# Altium schematic sheet Connector_SOM240_1.SchDoc: =SheetTitle_Top
size 420 x 297 mm; EDA_Number: ARTIQ; Author: G.Kasprowicz; CompanyName: WUT ISE; DrawnBy: G.Kasprowicz; Organization: WUT ISE; Address1: PW ISE; Address2: Nowowiejska 15/19 00-665 Warsaw; Address3: gkasprow@gmail.com; ModifiedBy: -; CheckedDate: -; Title2: K24/K26 SOM240_1 Connector; DivGrp: WUT ISE; Designer: G.Kasprowicz; ModifiedDate: -; ProjectName: Sensor Box
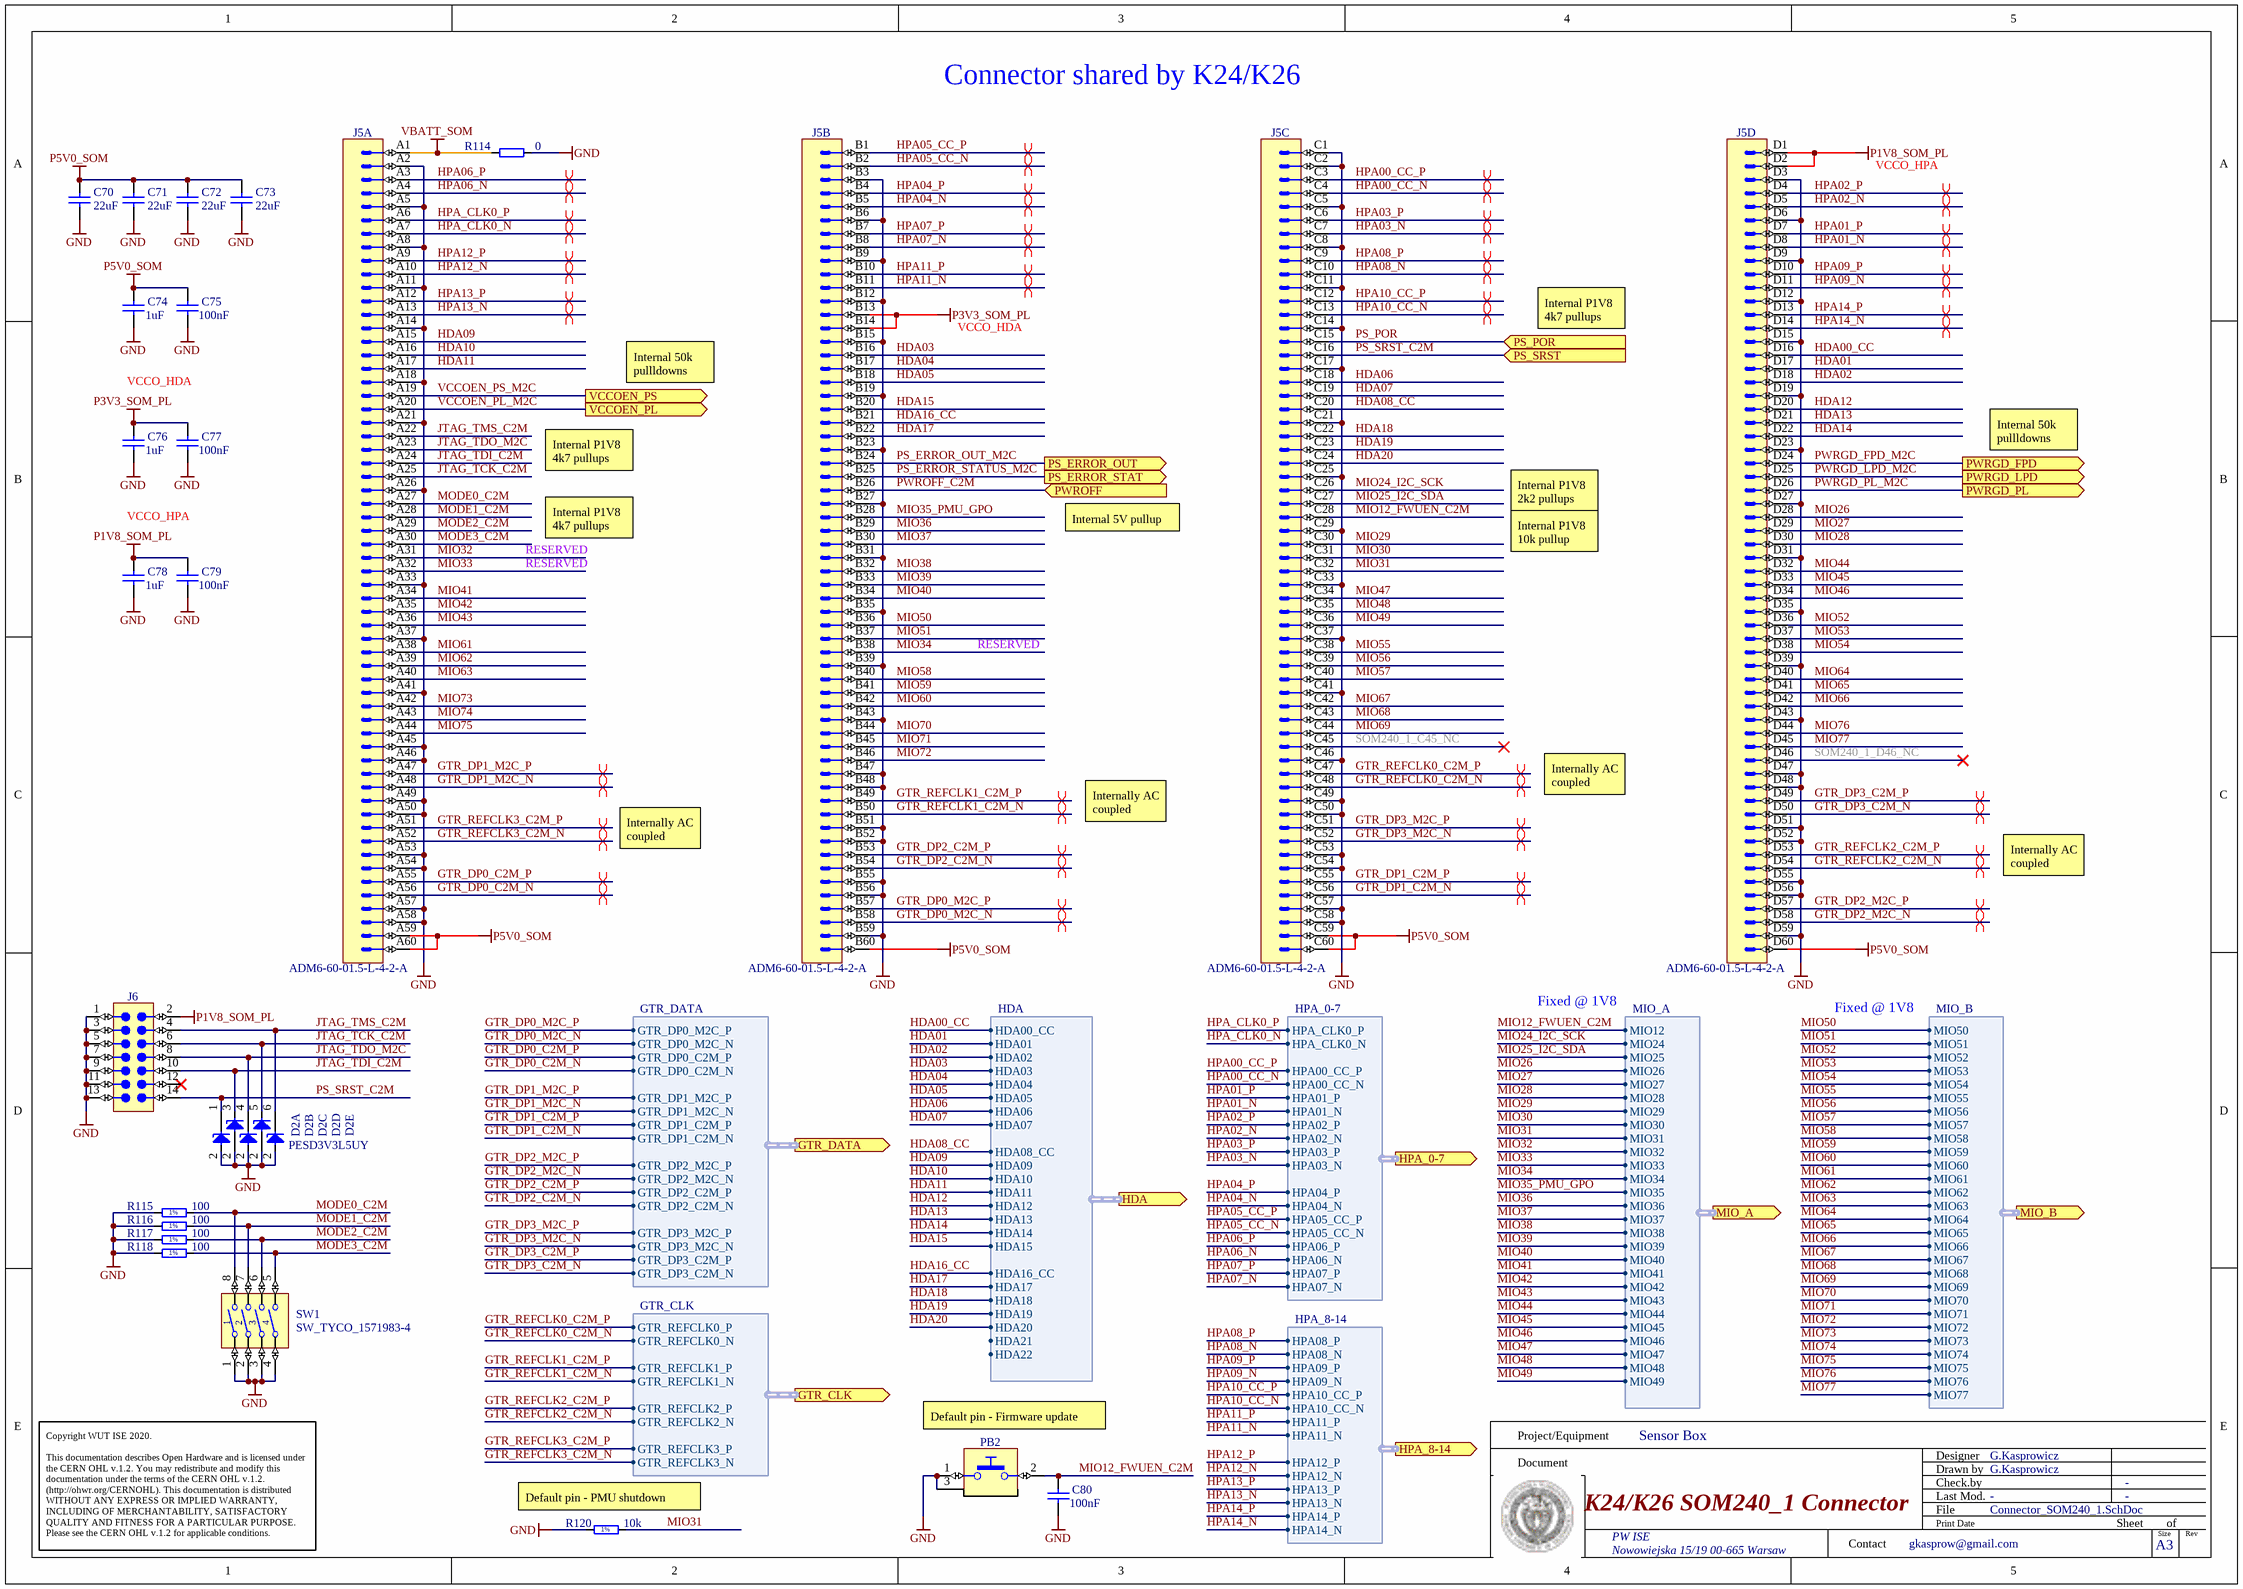
[diagram p0: Connector_SOM240_1.SchDoc]

## Parts
C70  22uF  [CAPC2012X135N]
C71  22uF  [CAPC2012X135N]
C72  22uF  [CAPC2012X135N]
C73  22uF  [CAPC2012X135N]
C74  1uF  [CAPC1005X55N]
C75  100nF  [CAPC1005X55N]
C76  1uF  [CAPC1005X55N]
C77  100nF  [CAPC1005X55N]
C78  1uF  [CAPC1005X55N]
C79  100nF  [CAPC1005X55N]
C80  100nF  [CAPC1005X55N]
D2  PESD3V3L5UY  [SOT65P210X110-6N]  (value not drawn)  (parts A,B,C,D,E of 5)
J5  Manufacturer Part Number: ADM6-60-01.5-L-4-2-A  [SAMTEC_ADM6-60-01.5-L-4-2-A]  (hidden comment: Header 240)  (parts A,B,C,D of 4)
J6  (no value)  [MOLEX_87832-1420]
PB2  (no value)  [PB_OMRON_B3U-1100P]
R114  0  [RESC1005X40N]
R115  100  [RESC1005X40N]
R116  100  [RESC1005X40N]
R117  100  [RESC1005X40N]
R118  100  [RESC1005X40N]
R120  10k  [RESC1005X40N]
SW1  Switch  [SW_TYCO_1571983-4]  (value not drawn)

## Ports
GTR_CLK (out, harness GTR_CLK), GTR_DATA (out, harness GTR_DATA), HDA (out, harness HDA), HPA_0-7 (out, harness HPA_0-7), HPA_8-14 (out, harness HPA_8-14), MIO_A (out, harness MIO_A), MIO_B (out, harness MIO_B), PS_ERROR_OUT (out), PS_ERROR_STAT (out), PS_POR (in), PS_SRST (in), PWRGD_FPD (out), PWRGD_LPD (out), PWRGD_PL (out), PWROFF (in), VCCOEN_PL (out), VCCOEN_PS (out)

## Harnesses
GTR_DATA: GTR_DP0_M2C_P, GTR_DP0_M2C_N, GTR_DP0_C2M_P, GTR_DP0_C2M_N, GTR_DP1_M2C_P, GTR_DP1_M2C_N, GTR_DP1_C2M_P, GTR_DP1_C2M_N, GTR_DP2_M2C_P, GTR_DP2_M2C_N, GTR_DP2_C2M_P, GTR_DP2_C2M_N, GTR_DP3_M2C_P, GTR_DP3_M2C_N, GTR_DP3_C2M_P, GTR_DP3_C2M_N
GTR_CLK: GTR_REFCLK0_P, GTR_REFCLK0_N, GTR_REFCLK1_P, GTR_REFCLK1_N, GTR_REFCLK2_P, GTR_REFCLK2_N, GTR_REFCLK3_P, GTR_REFCLK3_N
HDA: HDA00_CC, HDA01, HDA02, HDA03, HDA04, HDA06, HDA07, HDA05, HDA08_CC, HDA09, HDA10, HDA11, HDA12, HDA13, HDA14, HDA15, HDA16_CC, HDA17, HDA18, HDA19, HDA20, HDA21, HDA22
HPA_0-7: HPA_CLK0_P, HPA_CLK0_N, HPA00_CC_P, HPA00_CC_N, HPA01_P, HPA01_N, HPA02_P, HPA02_N, HPA03_P, HPA03_N, HPA04_P, HPA04_N, HPA05_CC_P, HPA05_CC_N, HPA06_P, HPA06_N, HPA07_P, HPA07_N
HPA_8-14: HPA08_P, HPA08_N, HPA09_P, HPA09_N, HPA10_CC_P, HPA10_CC_N, HPA11_P, HPA11_N, HPA12_P, HPA12_N, HPA13_P, HPA13_N, HPA14_P, HPA14_N
MIO_A: MIO12, MIO24, MIO25, MIO26, MIO27, MIO28, MIO29, MIO30, MIO31, MIO32, MIO33, MIO34, MIO35, MIO36, MIO37, MIO38, MIO39, MIO40, MIO41, MIO42, MIO43, MIO44, MIO45, MIO46, MIO47, MIO48, MIO49
MIO_B: MIO50, MIO51, MIO52, MIO53, MIO54, MIO55, MIO56, MIO57, MIO58, MIO59, MIO60, MIO61, MIO62, MIO63, MIO64, MIO65, MIO66, MIO67, MIO68, MIO69, MIO70, MIO71, MIO72, MIO73, MIO74, MIO75, MIO76, MIO77

## Nets
GND: C70.1 C71.1 C72.1 C73.1 C74.1 C75.1 C76.1 C77.1 C78.1 C79.1 C80.1 D2.2(A) J5.A2 J5.A5 J5.A8 J5.A11 J5.A14 J5.A18 J5.A21 J5.A26 J5.A33 J5.A37 J5.A41 J5.A45 J5.A46 J5.A49 J5.A50 J5.A53 J5.A54 J5.A57 J5.A58 J5.B3 J5.B6 J5.B9 J5.B12 J5.B15 J5.B19 J5.B23 J5.B27 J5.B31 J5.B35 J5.B39 J5.B43 J5.B47 J5.B48 J5.B51 J5.B52 J5.B55 J5.B56 J5.B59 J5.C1 J5.C2 J5.C5 J5.C8 J5.C11 J5.C14 J5.C17 J5.C21 J5.C25 J5.C29 J5.C33 J5.C37 J5.C41 J5.C46 J5.C49 J5.C50 J5.C53 J5.C54 J5.C57 J5.C58 J5.D3 J5.D6 J5.D9 J5.D12 J5.D15 J5.D19 J5.D23 J5.D27 J5.D31 J5.D35 J5.D39 J5.D43 J5.D47 J5.D48 J5.D51 J5.D52 J5.D55 J5.D56 J5.D59 J6.1 J6.3 J6.5 J6.7 J6.9 J6.11 J6.13 PB2.1 PB2.3 R114.2 R115.1 R116.1 R117.1 R118.1 R120.1 SW1.1 SW1.2 SW1.3 SW1.4
P1V8_SOM_PL: C78.2 C79.2 J5.D1 J5.D2 J6.2
P3V3_SOM_PL: C76.2 C77.2 J5.B13 J5.B14
P5V0_SOM: C70.2 C71.2 C72.2 C73.2 C74.2 C75.2 J5.A59 J5.A60 J5.B60 J5.C59 J5.C60 J5.D60
VBATT_SOM: J5.A1 R114.1
GTR_DP0_C2M_N: J5.A56 ; port GTR_DATA.GTR_DP0_C2M_N
GTR_DP0_C2M_P: J5.A55 ; port GTR_DATA.GTR_DP0_C2M_P
GTR_DP0_M2C_N: J5.B58 ; port GTR_DATA.GTR_DP0_M2C_N
GTR_DP0_M2C_P: J5.B57 ; port GTR_DATA.GTR_DP0_M2C_P
GTR_DP1_C2M_N: J5.C56 ; port GTR_DATA.GTR_DP1_C2M_N
GTR_DP1_C2M_P: J5.C55 ; port GTR_DATA.GTR_DP1_C2M_P
GTR_DP1_M2C_N: J5.A48 ; port GTR_DATA.GTR_DP1_M2C_N
GTR_DP1_M2C_P: J5.A47 ; port GTR_DATA.GTR_DP1_M2C_P
GTR_DP2_C2M_N: J5.B54 ; port GTR_DATA.GTR_DP2_C2M_N
GTR_DP2_C2M_P: J5.B53 ; port GTR_DATA.GTR_DP2_C2M_P
GTR_DP2_M2C_N: J5.D58 ; port GTR_DATA.GTR_DP2_M2C_N
GTR_DP2_M2C_P: J5.D57 ; port GTR_DATA.GTR_DP2_M2C_P
GTR_DP3_C2M_N: J5.D50 ; port GTR_DATA.GTR_DP3_C2M_N
GTR_DP3_C2M_P: J5.D49 ; port GTR_DATA.GTR_DP3_C2M_P
GTR_DP3_M2C_N: J5.C52 ; port GTR_DATA.GTR_DP3_M2C_N
GTR_DP3_M2C_P: J5.C51 ; port GTR_DATA.GTR_DP3_M2C_P
GTR_REFCLK0_C2M_N: J5.C48 ; port GTR_CLK.GTR_REFCLK0_N
GTR_REFCLK0_C2M_P: J5.C47 ; port GTR_CLK.GTR_REFCLK0_P
GTR_REFCLK1_C2M_N: J5.B50 ; port GTR_CLK.GTR_REFCLK1_N
GTR_REFCLK1_C2M_P: J5.B49 ; port GTR_CLK.GTR_REFCLK1_P
GTR_REFCLK2_C2M_N: J5.D54 ; port GTR_CLK.GTR_REFCLK2_N
GTR_REFCLK2_C2M_P: J5.D53 ; port GTR_CLK.GTR_REFCLK2_P
GTR_REFCLK3_C2M_N: J5.A52 ; port GTR_CLK.GTR_REFCLK3_N
GTR_REFCLK3_C2M_P: J5.A51 ; port GTR_CLK.GTR_REFCLK3_P
HDA00_CC: J5.D16 ; port HDA.HDA00_CC
HDA01: J5.D17 ; port HDA.HDA01
HDA02: J5.D18 ; port HDA.HDA02
HDA03: J5.B16 ; port HDA.HDA03
HDA04: J5.B17 ; port HDA.HDA04
HDA05: J5.B18 ; port HDA.HDA05
HDA06: J5.C18 ; port HDA.HDA06
HDA07: J5.C19 ; port HDA.HDA07
HDA08_CC: J5.C20 ; port HDA.HDA08_CC
HDA09: J5.A15 ; port HDA.HDA09
HDA10: J5.A16 ; port HDA.HDA10
HDA11: J5.A17 ; port HDA.HDA11
HDA12: J5.D20 ; port HDA.HDA12
HDA13: J5.D21 ; port HDA.HDA13
HDA14: J5.D22 ; port HDA.HDA14
HDA15: J5.B20 ; port HDA.HDA15
HDA16_CC: J5.B21 ; port HDA.HDA16_CC
HDA17: J5.B22 ; port HDA.HDA17
HDA18: J5.C22 ; port HDA.HDA18
HDA19: J5.C23 ; port HDA.HDA19
HDA20: J5.C24 ; port HDA.HDA20
HPA00_CC_N: J5.C4 ; port HPA_0-7.HPA00_CC_N
HPA00_CC_P: J5.C3 ; port HPA_0-7.HPA00_CC_P
HPA01_N: J5.D8 ; port HPA_0-7.HPA01_N
HPA01_P: J5.D7 ; port HPA_0-7.HPA01_P
HPA02_N: J5.D5 ; port HPA_0-7.HPA02_N
HPA02_P: J5.D4 ; port HPA_0-7.HPA02_P
HPA03_N: J5.C7 ; port HPA_0-7.HPA03_N
HPA03_P: J5.C6 ; port HPA_0-7.HPA03_P
HPA04_N: J5.B5 ; port HPA_0-7.HPA04_N
HPA04_P: J5.B4 ; port HPA_0-7.HPA04_P
HPA05_CC_N: J5.B2 ; port HPA_0-7.HPA05_CC_N
HPA05_CC_P: J5.B1 ; port HPA_0-7.HPA05_CC_P
HPA06_N: J5.A4 ; port HPA_0-7.HPA06_N
HPA06_P: J5.A3 ; port HPA_0-7.HPA06_P
HPA07_N: J5.B8 ; port HPA_0-7.HPA07_N
HPA07_P: J5.B7 ; port HPA_0-7.HPA07_P
HPA08_N: J5.C10 ; port HPA_8-14.HPA08_N
HPA08_P: J5.C9 ; port HPA_8-14.HPA08_P
HPA09_N: J5.D11 ; port HPA_8-14.HPA09_N
HPA09_P: J5.D10 ; port HPA_8-14.HPA09_P
HPA10_CC_N: J5.C13 ; port HPA_8-14.HPA10_CC_N
HPA10_CC_P: J5.C12 ; port HPA_8-14.HPA10_CC_P
HPA11_N: J5.B11 ; port HPA_8-14.HPA11_N
HPA11_P: J5.B10 ; port HPA_8-14.HPA11_P
HPA12_N: J5.A10 ; port HPA_8-14.HPA12_N
HPA12_P: J5.A9 ; port HPA_8-14.HPA12_P
HPA13_N: J5.A13 ; port HPA_8-14.HPA13_N
HPA13_P: J5.A12 ; port HPA_8-14.HPA13_P
HPA14_N: J5.D14 ; port HPA_8-14.HPA14_N
HPA14_P: J5.D13 ; port HPA_8-14.HPA14_P
HPA_CLK0_N: J5.A7 ; port HPA_0-7.HPA_CLK0_N
HPA_CLK0_P: J5.A6 ; port HPA_0-7.HPA_CLK0_P
JTAG_TCK_C2M: D2.5(C) J5.A25 J6.6
JTAG_TDI_C2M: D2.3(C) J5.A24 J6.10
JTAG_TDO_M2C: D2.4(C) J5.A23 J6.8
JTAG_TMS_C2M: D2.6(C) J5.A22 J6.4
MIO12_FWUEN_C2M: C80.2 J5.C28 PB2.2 ; port MIO_A.MIO12
MIO24_I2C_SCK: J5.C26 ; port MIO_A.MIO24
MIO25_I2C_SDA: J5.C27 ; port MIO_A.MIO25
MIO26: J5.D28 ; port MIO_A.MIO26
MIO27: J5.D29 ; port MIO_A.MIO27
MIO28: J5.D30 ; port MIO_A.MIO28
MIO29: J5.C30 ; port MIO_A.MIO29
MIO30: J5.C31 ; port MIO_A.MIO30
MIO31: J5.C32 R120.2 ; port MIO_A.MIO31
MIO32: J5.A31 ; port MIO_A.MIO32
MIO33: J5.A32 ; port MIO_A.MIO33
MIO34: J5.B38 ; port MIO_A.MIO34
MIO35_PMU_GPO: J5.B28 ; port MIO_A.MIO35
MIO36: J5.B29 ; port MIO_A.MIO36
MIO37: J5.B30 ; port MIO_A.MIO37
MIO38: J5.B32 ; port MIO_A.MIO38
MIO39: J5.B33 ; port MIO_A.MIO39
MIO40: J5.B34 ; port MIO_A.MIO40
MIO41: J5.A34 ; port MIO_A.MIO41
MIO42: J5.A35 ; port MIO_A.MIO42
MIO43: J5.A36 ; port MIO_A.MIO43
MIO44: J5.D32 ; port MIO_A.MIO44
MIO45: J5.D33 ; port MIO_A.MIO45
MIO46: J5.D34 ; port MIO_A.MIO46
MIO47: J5.C34 ; port MIO_A.MIO47
MIO48: J5.C35 ; port MIO_A.MIO48
MIO49: J5.C36 ; port MIO_A.MIO49
MIO50: J5.B36 ; port MIO_B.MIO50
MIO51: J5.B37 ; port MIO_B.MIO51
MIO52: J5.D36 ; port MIO_B.MIO52
MIO53: J5.D37 ; port MIO_B.MIO53
MIO54: J5.D38 ; port MIO_B.MIO54
MIO55: J5.C38 ; port MIO_B.MIO55
MIO56: J5.C39 ; port MIO_B.MIO56
MIO57: J5.C40 ; port MIO_B.MIO57
MIO58: J5.B40 ; port MIO_B.MIO58
MIO59: J5.B41 ; port MIO_B.MIO59
MIO60: J5.B42 ; port MIO_B.MIO60
MIO61: J5.A38 ; port MIO_B.MIO61
MIO62: J5.A39 ; port MIO_B.MIO62
MIO63: J5.A40 ; port MIO_B.MIO63
MIO64: J5.D40 ; port MIO_B.MIO64
MIO65: J5.D41 ; port MIO_B.MIO65
MIO66: J5.D42 ; port MIO_B.MIO66
MIO67: J5.C42 ; port MIO_B.MIO67
MIO68: J5.C43 ; port MIO_B.MIO68
MIO69: J5.C44 ; port MIO_B.MIO69
MIO70: J5.B44 ; port MIO_B.MIO70
MIO71: J5.B45 ; port MIO_B.MIO71
MIO72: J5.B46 ; port MIO_B.MIO72
MIO73: J5.A42 ; port MIO_B.MIO73
MIO74: J5.A43 ; port MIO_B.MIO74
MIO75: J5.A44 ; port MIO_B.MIO75
MIO76: J5.D44 ; port MIO_B.MIO76
MIO77: J5.D45 ; port MIO_B.MIO77
MODE0_C2M: J5.A27 R115.2 SW1.8
MODE1_C2M: J5.A28 R116.2 SW1.7
MODE2_C2M: J5.A29 R117.2 SW1.6
MODE3_C2M: J5.A30 R118.2 SW1.5
PS_ERROR_OUT_M2C: J5.B24 ; port PS_ERROR_OUT
PS_ERROR_STATUS_M2C: J5.B25 ; port PS_ERROR_STAT
PS_POR: J5.C15 ; port PS_POR
PS_SRST_C2M: D2.1(C) J5.C16 J6.14 ; port PS_SRST
PWRGD_FPD_M2C: J5.D24 ; port PWRGD_FPD
PWRGD_LPD_M2C: J5.D25 ; port PWRGD_LPD
PWRGD_PL_M2C: J5.D26 ; port PWRGD_PL
PWROFF_C2M: J5.B26 ; port PWROFF
SOM240_1_C45_NC: J5.C45
SOM240_1_D46_NC: J5.D46
VCCOEN_PL_M2C: J5.A20 ; port VCCOEN_PL
VCCOEN_PS_M2C: J5.A19 ; port VCCOEN_PS

Not connected (* = marked no-connect by the designer): J6 12*

## Layout directives
differential pair; differential pair class Diff_GTR: GTR_DP0_C2M_N, GTR_DP0_C2M_P, GTR_DP0_M2C_N, GTR_DP0_M2C_P, GTR_DP1_C2M_N, GTR_DP1_C2M_P, GTR_DP1_M2C_N, GTR_DP1_M2C_P, GTR_DP2_C2M_N, GTR_DP2_C2M_P, GTR_DP2_M2C_N, GTR_DP2_M2C_P, GTR_DP3_C2M_N, GTR_DP3_C2M_P, GTR_DP3_M2C_N, GTR_DP3_M2C_P, GTR_REFCLK0_C2M_N, GTR_REFCLK0_C2M_P, GTR_REFCLK1_C2M_N, GTR_REFCLK1_C2M_P, GTR_REFCLK2_C2M_N, GTR_REFCLK2_C2M_P, GTR_REFCLK3_C2M_N, GTR_REFCLK3_C2M_P
differential pair; differential pair class Diff_HPA: HPA00_CC_N, HPA00_CC_P, HPA01_N, HPA01_P, HPA02_N, HPA02_P, HPA03_N, HPA03_P, HPA04_N, HPA04_P, HPA05_CC_N, HPA05_CC_P, HPA06_N, HPA06_P, HPA07_N, HPA07_P, HPA08_N, HPA08_P, HPA09_N, HPA09_P, HPA10_CC_N, HPA10_CC_P, HPA11_N, HPA11_P, HPA12_N, HPA12_P, HPA13_N, HPA13_P, HPA14_N, HPA14_P, HPA_CLK0_N, HPA_CLK0_P

## Notes on the sheet
- Connector shared by K24/K26
- VCCO_HPA
- Internal P1V8 4k7 pullups
- VCCO_HDA
- Internal 50k pullldowns
- Internal 5V pullup
- Internal P1V8 2k2 pullups
- RESERVED
- Internal P1V8 10k pullup
- Internally AC coupled
- Fixed @ 1V8
- Default pin - Firmware update
- (near R120) Default pin - PMU shutdown
- Project/Equipment
- Document
- Designer
- Drawn by
- Check.by
- Copyright WUT ISE 2020.
  This documentation describes Open Hardware and is licensed under the CERN OHL v.1.2. You may redistribute and modify this documentation under the terms of the CERN OHL v.1.2. (http://ohwr.org/CERNOHL). This documentation is distributed WITHOUT ANY EXPRESS OR IMPLIED WARRANTY, INCLUDING OF MERCHANTABILITY, SATISFACTORY QUALITY AND FITNESS FOR A PARTICULAR PURPOSE. Please see the CERN OHL v.1.2 for applicable conditions.
- Contact
- File
- Last Mod.
- Print Date
- Sheet
- Size
- A3
- of
- Rev
- (in symbol R0402_10K_1%_0.0625W_100PPM) 1%
- (in symbol R0402_100R_1%_0.0625W_100PPM) 1%

## Library data of the parts
C70-C73 = CC0805_22UF_16V_10%_X5R: Non-polarised capacitor; Part Description: SMD Multilayer Chip Ceramic Capacitor; Manufacturer: GENERIC; Manufacturer1 Part Number: C2012X5R1C226KT; Voltage: 16V; TC: X5R; Tolerance: ±10%; Part Number: CC0805_22UF_16V_10%_X5R; Component Kind: Standard; Component Type: Standard; Pin Count: 2; Value: 22uF; Status: Preferred; Manufacturer Part Number: CC0805_22UF_16V_10%_X5R; Case: 0805; Mounted: Yes; Socket: No; SMD: Yes; Sense: No; Manufacturer1 Example: TDK; Manufacturer1 ComponentHeight: 1.35mm; HelpURL: \\cern.ch\dfs\Applications\Altium\Datasheets\CC0805_X5R_TDK_C.pdf; Author: CERN DEM JLC; CreateDate: 25.10.2012; LatestRevisionDate: 25.10.2012
C74 C76 C78 = CC0402_1UF_16V_10%_X5R: Non-polarised capacitor; Part Description: SMD Multilayer Chip Ceramic Capacitor; Manufacturer: GENERIC; Manufacturer1 Part Number: C1005X5R1C105KT; Voltage: 16V; TC: X5R; Tolerance: ±10%; Part Number: CC0402_1UF_16V_10%_X5R; Component Kind: Standard; Component Type: Standard; Pin Count: 2; Value: 1uF; Status: Preferred; Manufacturer Part Number: CC0402_1UF_16V_10%_X5R; Case: 0402; Mounted: Yes; Socket: No; SMD: Yes; Sense: No; Manufacturer1 Example: TDK; Manufacturer1 ComponentHeight: 0.55mm; HelpURL: \\cern.ch\dfs\Applications\Altium\Datasheets\CC0402_X5R_TDK_C.pdf; Author: CERN DEM JLC; CreateDate: 2012-10-25; LatestRevisionDate: 2012-10-25
C75 C77 C79 C80 = CC0402_100NF_16V_10%_X5R: Non-polarised capacitor; Part Description: SMD Multilayer Chip Ceramic Capacitor; Manufacturer: GENERIC; Manufacturer1 Part Number: GRM155R61C104KA88D; Voltage: 16V; TC: X5R; Tolerance: ±10%; Part Number: CC0402_100NF_16V_10%_X5R; Component Kind: Standard; Component Type: Standard; Pin Count: 2; Value: 100nF; Status: None; Manufacturer Part Number: CC0402_100NF_16V_10%_X5R; Case: 0402; Mounted: Yes; Socket: No; SMD: Yes; Sense: No; Manufacturer1 Example: MURATA; Manufacturer1 ComponentHeight: 0.55mm; HelpURL: \\cern.ch\dfs\Applications\Altium\Datasheets\CC0402_X5R_MURATA_GRM.pdf; Author: CERN DEM JLC; CreateDate: 10.12.2013; LatestRevisionDate: 10.12.2013
D2 = PESD3V3L5UY: Fivefold ESD Protection Diode Arrays; Part Description: Fivefold ESD Protection Diode Arrays (30kV); Manufacturer: NEXPERIA; Voltage: 3.3V; Power: 200W; PressFit: No; Bonding: No; Part Number: PESD3V3L5UY; Component Kind: Standard; Component Type: Standard; Device: PESD3V3L5UY; PackageDescription: SOT363, SC-88, 0.65mm Pitch; 6 Pin, 1.25mm W X 2.00mm L X 1.10mm H body, IPC Medium Density; Manufacturer Part Number: PESD3V3L5UY; Pin Count: 6; Case: SOT363; Mounted: Yes; Socket: No; SMD: Yes; Sense: No; ComponentHeight: 1.1mm; HelpURL: \\cern.ch\dfs\Applications\Altium\Datasheets\PESD3V3L5UY.pdf; Author: CERN DEM WB; CreateDate: 05.07.2021; LatestRevisionDate: 05.07.2021
J5 = SAMTEC_ADM6-60-01.5-L-4-2-A: Connector 240 Male contacts in 4 row abcd; Part Description: 240 contacts (4 rows abcd) High-Density  Slim Body Arrays Male Connector; Manufacturer: SAMTEC; PressFit: No; Part Number: SAMTEC_ADM6-60-01.5-L-4-2-A; Component Kind: Standard; Component Type: Standard; Pin Count: 240; Family: Header 240; Mounted: Yes; Socket: No; SMD: Yes; Sense: No; Status: None; ComponentHeight: 4.1mm; HelpURL: \\cern.ch\dfs\Applications\Altium\Datasheets\SAMTEC_ADM6-60-01.5-L-4-2-A.pdf; Author: CERN DEM HF; CreateDate: 27/10/2021; LatestRevisionDate: 11/01/2022
J6 = MOLEX_87832-1420: Connector 14 Male; Part Description: 2.00mm (.079") Pitch Milli-Grid™ Header, Surface Mount, Vertical, Shrouded, 14 Circuits, with Locking Windows and Centre Polarization Slot, PCB Locator; Manufacturer: MOLEX; PressFit: No; Part Number: MOLEX_87832-1420; Component Kind: Standard; Component Type: Standard; Pin Count: 14; Family: Milli-Grid™; Mounted: Yes; Socket: No; SMD: Yes; Manufacturer Part Number: 87832-1420; ComponentHeight: 7.6mm; HelpURL: \\cern.ch\dfs\Applications\Altium\Datasheets\MOLEX_87832-1420.pdf; Author: CERN DEM JLC; CreateDate: 9/9/2008; LatestRevisionDate: 9/9/2008; Table: MOLEX; Status: None; Supplier: Radiospares; SupplierRef: 6701071; Sense: No
PB2 = PB_OMRON_B3U-1100P: Push-Button Switch SPDT; Part Description: 3x2.5mm Ultra-Small Tactile SPST Pushbutton Switch (with Ground Terminal),Contact Rating 50mA 12VDC, B3U Series; Manufacturer: OMRON; PressFit: No; Part Number: PB_OMRON_B3U-1100P; Component Kind: Standard; Component Type: Standard; Pin Count: 3; PackageDescription: Body 1.2x3x2.5mm Ultra-Small Tactile SPST Pushbutton Switch, (with Ground Terminal), OMRON B3U Series; Family: Push Button; Mounted: Yes; Socket: No; SMD: Yes; Sense: No; Status: None; Manufacturer Part Number: B3U-1100P; ComponentHeight: 1.75mm; HelpURL: \\cern.ch\dfs\Applications\Altium\Datasheets\PB_OMRON_B3U-1100P.pdf; Author: CERN DEM JLC; CreateDate: 3/16/2010; LatestRevisionDate: 6/16/2022
R114 = R0402_0R_JUMPER: Resistor; Part Description: 1A (0.05R Max DC Resistance) Zero Ohm Jumper; Manufacturer: GENERIC; Manufacturer1 Part Number: 232270591001L; PressFit: No; Part Number: R0402_0R_JUMPER; Component Kind: Standard; Component Type: Standard; Pin Count: 2; Value: 0; Status: Not Recommended; Manufacturer Part Number: R0402_0R_JUMPER; Case: 0402; Mounted: Yes; Sense: No; Socket: No; SMD: Yes; Manufacturer1 Example: YAGEO PHYCOMP; Manufacturer1 ComponentHeight: 0.4mm; HelpURL: \\cern.ch\dfs\Applications\Altium\Datasheets\R0402_Phycomp_RC0402.pdf; Author: CERN DEM JLC; CreateDate: 03.12.2007; LatestRevisionDate: 17.10.2012
R115-R118 = R0402_100R_1%_0.0625W_100PPM: Resistor - 1%; Part Description: General Purpose Thick Film Chip Resistor; Manufacturer: GENERIC; Manufacturer1 Part Number: 232270671001L; TC: ±100ppm/°C; PressFit: No; Mounted: No; Part Number: R0402_100R_1%_0.0625W_100PPM; Component Kind: Standard; Component Type: Standard; Pin Count: 2; Value: 100; Status: Not Recommended; Power: 0.0625W; Tolerance: ±1%; Manufacturer Part Number: R0402_100R_1%_0.0625W_100PPM; Case: 0402; Sense: No; Socket: No; SMD: Yes; Manufacturer1 Example: YAGEO PHYCOMP; Manufacturer1 ComponentHeight: 0.4mm; HelpURL: \\cern.ch\dfs\Applications\Altium\Datasheets\R0402_Phycomp_RC0402.pdf; Author: CERN DEM JLC; CreateDate: 03-Dec-07; LatestRevisionDate: 17-Oct-12
R120 = R0402_10K_1%_0.0625W_100PPM: Resistor - 1%; Part Description: General Purpose Thick Film Chip Resistor; Manufacturer: GENERIC; Manufacturer1 Part Number: 232270671003L; TC: ±100ppm/°C; PressFit: No; Part Number: R0402_10K_1%_0.0625W_100PPM; Component Kind: Standard; Component Type: Standard; Pin Count: 2; Value: 10k; Status: Not Recommended; Power: 0.0625W; Tolerance: ±1%; Manufacturer Part Number: R0402_10K_1%_0.0625W_100PPM; Case: 0402; Mounted: Yes; Sense: No; Socket: No; SMD: Yes; Manufacturer1 Example: YAGEO PHYCOMP; Manufacturer1 ComponentHeight: 0.4mm; HelpURL: \\cern.ch\dfs\Applications\Altium\Datasheets\R0402_Phycomp_RC0402.pdf; Author: CERN DEM JLC; CreateDate: 03.12.2007; LatestRevisionDate: 17.10.2012
SW1 = SW_TYCO_1571983-4: 4 Ways SPST DIP Switch; Part Description: 4 Way SPST SMD DIP Switch, Latched, Contact Rating 0.025A 24VDC; Manufacturer: TYCO; Manufacturer Part Number: 1571983-4 or GDH04S04; PressFit: No; Part Number: SW_TYCO_1571983-4; Component Kind: Standard; Component Type: Standard; Pin Count: 8; PackageDescription: Pitch 1.27mm,  Body 6.2x6.2mm, 4 Ways SPST Surface-Mount DIP Switch, TYCO GDH Series; Family: Switch; Mounted: Yes; Socket: No; SMD: Yes; Sense: No; Status: None; ComponentHeight: 2.31mm; HelpURL: \\cern.ch\dfs\Applications\Altium\Datasheets\SW_TYCO_1571983-4.pdf; Author: CERN DEM JLC; CreateDate: 08-Jan-09; LatestRevisionDate: 08-Jan-09